# EAGLE design Sip_And_Puff_Analog_Switch (EAGLE 9.6.1)
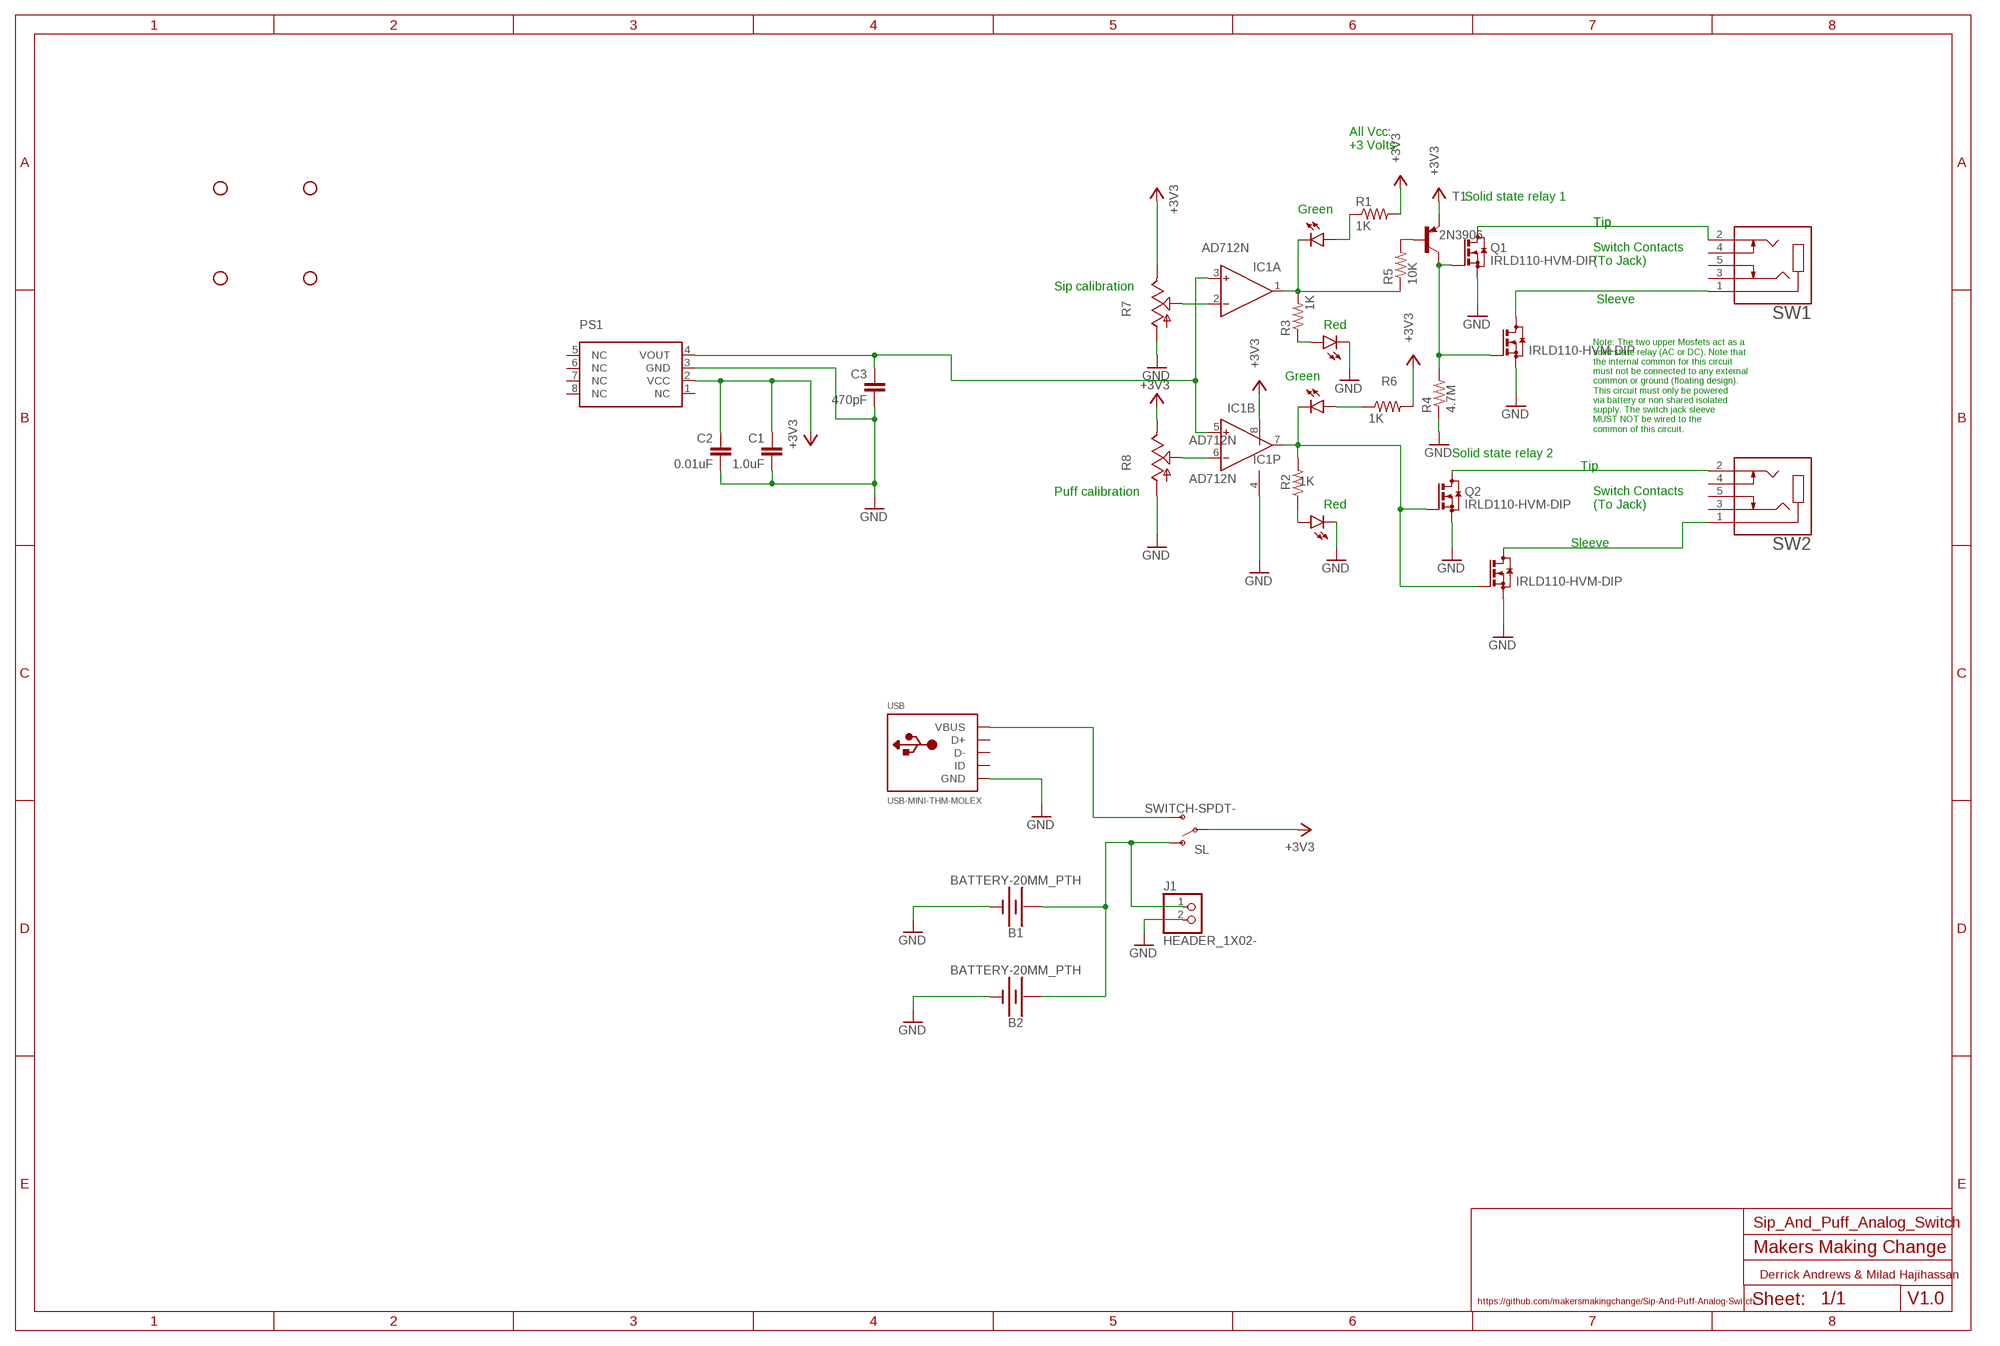
[diagram p0: schematic, sheet 1]

## Parts
B1  BATTERY-20MM_PTH  [BATTCOM_20MM_PTH]
B2  BATTERY-20MM_PTH  [BATTCOM_20MM_PTH]
C1  1.0uF  CAPACITOR-EU-  [CAP-PTH-SMALL-KIT]
C2  0.01uF  CAPACITOR-EU-  [CAP-PTH-SMALL-KIT]
C3  470pF  CAPACITOR-EU-  [CAP-PTH-SMALL-KIT]
IC1  AD712N  [DIL08]
J1  HEADER_1X02-  [1X02]
LED1  LED5MM-RED  [LED_5MM_RED]
LED2  LED5MM-RED  [LED_5MM_RED]
LED3  LED5MM-GREEN  [LED_5MM_GREEN]
LED4  LED5MM-GREEN  [LED_5MM_GREEN]
PS1  MPX-  [MXP_SOP8]
Q1  IRLD110-HVM-DIP  [HVM-DIP]
Q2  IRLD110-HVM-DIP  [HVM-DIP]
Q3  IRLD110-HVM-DIP  [HVM-DIP]
Q4  IRLD110-HVM-DIP  [HVM-DIP]
R1  1K  RESISTOR-US-0207/7  [RESISTOR_0207/7]
R2  1K  RESISTOR-US-0207/7  [RESISTOR_0207/7]
R3  1K  RESISTOR-US-0207/7  [RESISTOR_0207/7]
R4  4.7M  RESISTOR-US-0207/7  [RESISTOR_0207/7]
R5  10K  RESISTOR-US-0207/7  [RESISTOR_0207/7]
R6  1K  RESISTOR-US-0207/7  [RESISTOR_0207/7]
R7  TRIM-3386C  [3386C]
R8  TRIM-3386C  [3386C]
SL  SWITCH-SPDT-  [SPDT-RA]
STANDOFF1  STAND-OFF-  [STAND-OFF]
STANDOFF2  STAND-OFF-  [STAND-OFF]
STANDOFF3  STAND-OFF-  [STAND-OFF]
STANDOFF4  STAND-OFF-  [STAND-OFF]
SW1  CUI_SJ1-3535NGSJ1-3535NG  [CUI_SJ1-3535NG]
SW2  CUI_SJ1-3535NGSJ1-3535NG  [CUI_SJ1-3535NG]
T1  2N3906  [TO92-EBC]
USB  USB-MINI-THM-MOLEX  [USB-MINIB-THM-MOLEX]

## Nets
+3V3: C1.1 C2.1 IC1.8(P:V+) PS1.2(VCC) R1.2 R6.2 R7.E R8.E SL.2(P) T1.E
GND: B1.- B2.- C1.2 C2.2 C3.2 IC1.4(P:V-) J1.2 LED1.K(C) LED2.K(C) PS1.3(GND) Q1.2(S) Q2.2(S) Q3.2(S) Q4.2(S) R4.1 R7.A R8.A USB.GND
N$1: IC1.7(B:OUT) LED4.K(C) Q2.1(G) Q4.1(G) R2.2
N$3: SL.3(S) USB.VBUS
N$4: LED4.A R6.1
N$5: B1.+ B2.+ J1.1 SL.1(O)
N$7: Q3.3(D) SW1.1
N$9: Q1.3(D) SW1.2
N$10: Q1.1(G) Q3.1(G) R4.2 T1.C
N$11: R5.2 T1.B
N$12: IC1.1(A:OUT) LED3.K(C) R3.2 R5.1
N$13: IC1.2(A:IN-) R7.S
N$14: IC1.6(B:IN-) R8.S
N$15: C3.1 IC1.3(A:IN+) IC1.5(B:IN+) PS1.4(VOUT)
N$17: Q2.3(D) SW2.2
N$18: Q4.3(D) SW2.1
N$19: LED3.A R1.1
N$20: LED2.A R2.1
N$21: LED1.A R3.1
Unconnected: PS1.1(NC) PS1.5(NC) PS1.6(NC) PS1.7(NC) PS1.8(NC) SW1.3 SW1.4 SW1.5 SW2.3 SW2.4 SW2.5 USB.D+ USB.D- USB.ID

## Notes on the sheet
- All Vcc:
  +3 Volts
- Solid state relay 1
- Green
- Tip | Tip
- Switch Contacts
  (To Jack)
- Sip calibration
- Sleeve
- Red
- Green
- Note: The two upper Mosfets act as a
  solid state relay (AC or DC). Note that
  the internal common for this circuit
  must not be connected to any external
  common or ground (floating design).
  This circuit must only be powered
  via battery or non shared isolated
  supply. The switch jack sleeve 
  MUST NOT be wired to the
  common of this circuit.
- Solid state relay 2
- Tip
- Puff calibration
- Red
- Switch Contacts
  (To Jack)
- Sleeve
- Makers Making Change
- Derrick Andrews & Milad Hajihassan
- https://github.com/makersmakingchange/Sip-And-Puff-Analog-Switch | V1.0

## Library data of the parts
B1 B2 = MMC Eagle:BATTERY-
C1-C3 = MMC Eagle:CAPACITOR-EU-
IC1 = MMC Eagle:AD712: Dual Precision, Low Cost, High Speed BiFET Op Amp Source: http://www.analog.com/static/imported-files/data_sheets/AD712.pdf; MF: ALTERA CORPORATION; MPN: AD712JNZ; OC_FARNELL: 9604898; OC_NEWARK: 59K4554
J1 = MMC Eagle:HEADER_1X02-
LED1-LED4 = MMC Eagle:LED: LED (Generic) Standard schematic elements and footprints for 5mm, 3mm, 1206, and 0603 sized LEDs. Generic LEDs with no color specified.
PS1 = MMC Eagle:MPX-: Generic MPX pressure sensor
Q1-Q4 = MMC Eagle:IRLD110
R1-R6 = MMC Eagle:RESISTOR-US-: RESISTOR, American symbol
R7 R8 = MMC Eagle:TRIM-: POTENTIOMETER
SL = MMC Eagle:SWITCH-SPDT-
STANDOFF1-STANDOFF4 = MMC Eagle:STAND-OFF-
SW1 SW2 = MMC Eagle:CUI_SJ1-3535NG
T1 = MMC Eagle:2N3906: PNP Transistor
USB = MMC Eagle:USB-MINI-

## Net classes
2 GND2: clearance 0.205 mm to class 0, clearance 0.205 mm to class 1, clearance 0.205 mm
3 GND3: clearance 0.205 mm to class 0, clearance 0.205 mm to class 1, clearance 0.205 mm to class 2, clearance 0.205 mm

## Board
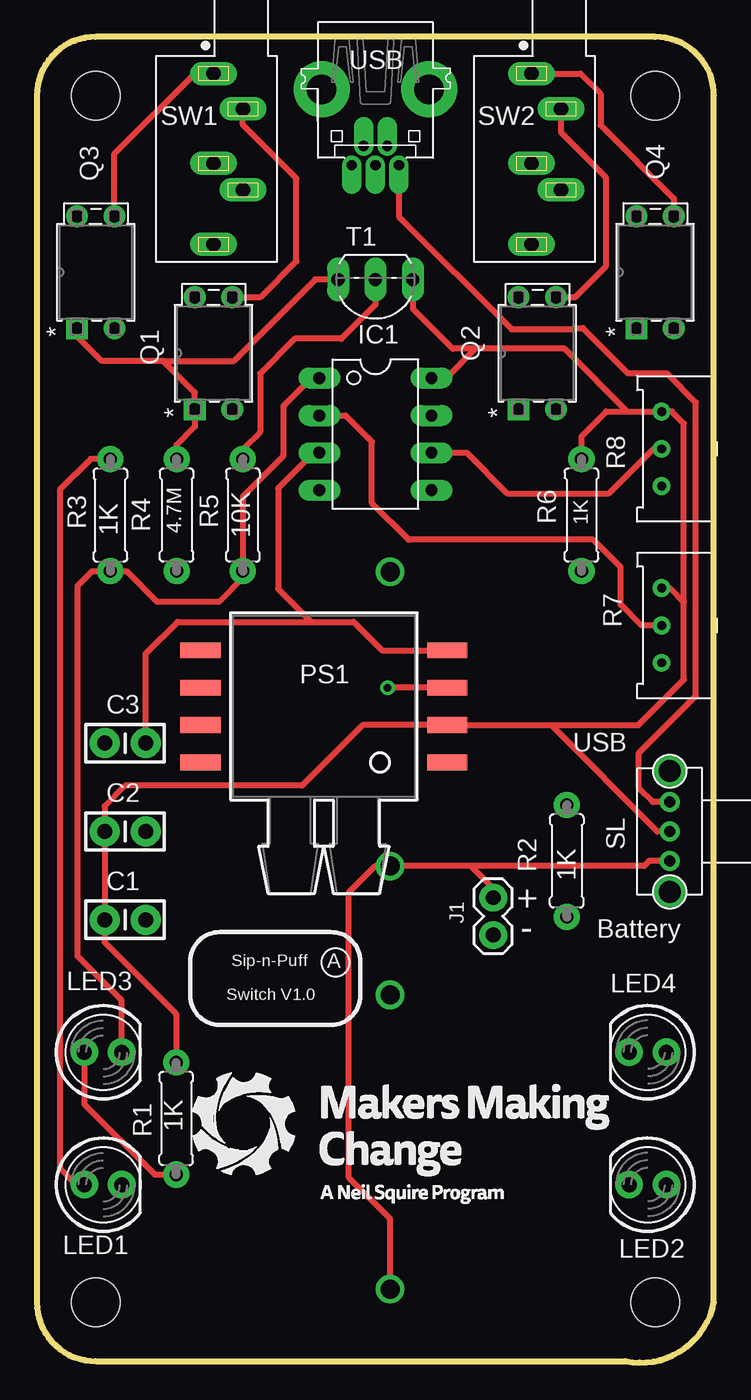
[diagram p1: board, top side]
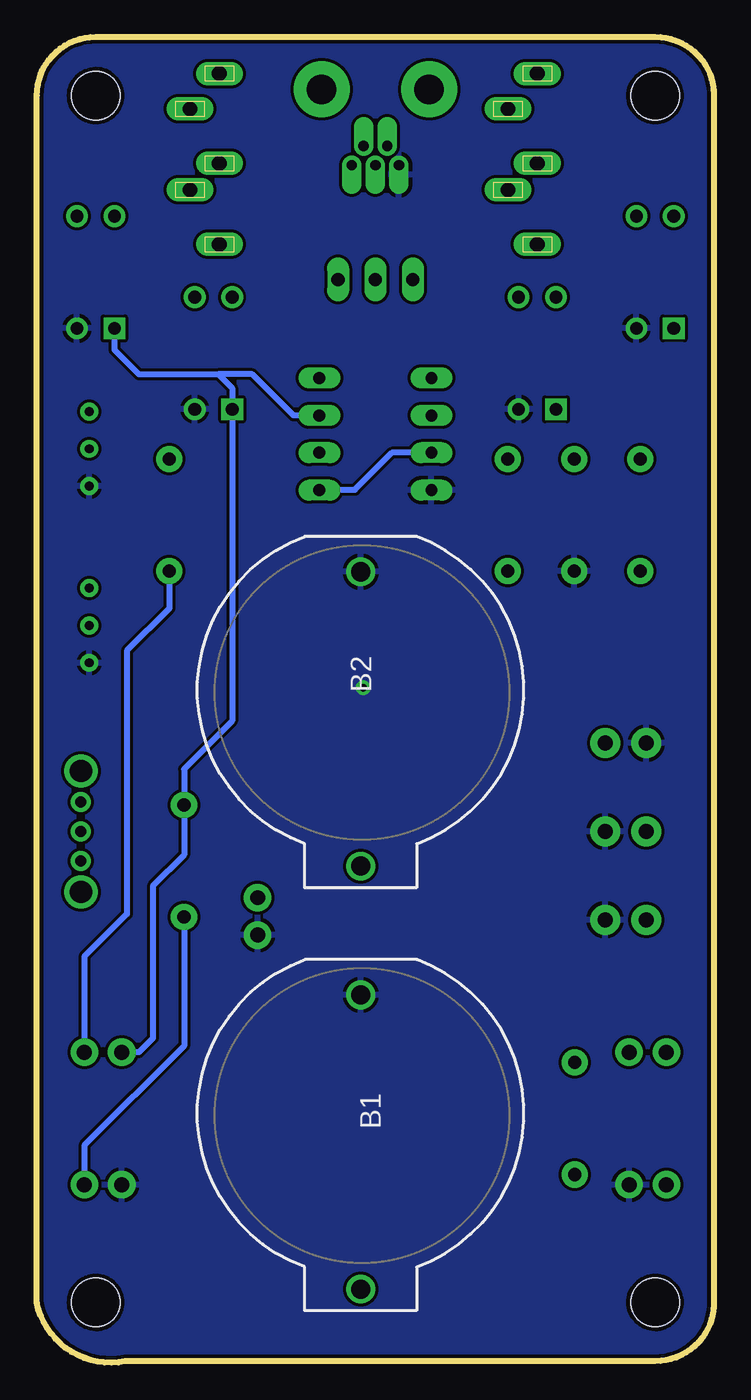
[diagram p2: board, bottom side, seen from below]

Size 46 x 90.1 mm. Coordinates in mm from the lower left corner, seen from the top.
Outline: 4,0.1 40,0.1 arc90 46,4.1 46,86.1 arc90 42,90.1 4,90.1 arc90 0,86.1 0,4.1 arc90 4,0.1
Copper layers (1*16): Top 0.035mm / dielectric 1.5mm / Bottom 0.035mm
Design rules "SparkFun": minimum track width 8mil, minimum drill 20mil, track to track 8mil, track to pad 8mil, pad to pad 8mil, via to via 8mil, smd to smd 8mil, copper to edge 10mil, drill to drill 8mil, minimum pad ring 12mil, minimum via ring 10mil, stop-mask expansion 4mil, vias tented up to drill 25mil, thermal gap 10mil

### Footprints (pad centres in the part's own frame; a part is rotated, then mirrored left to right if it is on the bottom)
BATTCOM_20MM_PTH = drill 1.3: + 11.85,0; - -8.15,0
CAP-PTH-SMALL-KIT = drill 1.016 pad 2.032: 1 -1.397,0; 2 1.397,0
DIL08 = drill 0.813 long: 1 -3.81,-3.81; 2 -1.27,-3.81; 3 1.27,-3.81; 4 3.81,-3.81; 5 3.81,3.81; 6 1.27,3.81; 7 -1.27,3.81; 8 -3.81,3.81
1X02 = drill 1.016 pad 1.88: 1 0,0; 2 2.54,0
LED_5MM_RED = drill 1.016 pad 1.88: A -1.27,0; K 1.27,0
LED_5MM_GREEN = drill 1.016 pad 1.88: A -1.27,0; K 1.27,0
MXP_SOP8 = smd 2.731 x 1.067: 1 8.382,-3.81; 2 8.382,-1.27; 3 8.382,1.27; 4 8.382,3.81; 5 -8.382,3.81; 6 -8.382,1.27; 7 -8.382,-1.27; 8 -8.382,-3.81
HVM-DIP = drill 0.864 pad 1.372 square: 1 -3.81,1.27 | drill 0.864 pad 1.372: 2 -3.81,-1.27; 3 3.81,-1.27; 4 3.81,1.27
RESISTOR_0207/7 = drill 0.889 pad 1.778: 1 -3.81,0; 2 3.81,0
3386C = drill 0.6: A 2.54,0; E -2.54,0; S 0,0
SPDT-RA = drill 0.75: 1 -2,0; 2 0,0; 3 2,0 | drill 1.5 pad 1.93: P$1 -4.1,0; P$2 4.1,0
STAND-OFF = hole 3.302: 0,0
CUI_SJ1-3535NG = drill 1 long: 1 0,0; 2 2.4,2; 3 7.9,2; 4 11.6,0; 5 6.1,0
TO92-EBC = drill 0.889 long: B 0,0; C 2.54,0; E -2.54,0
USB-MINIB-THM-MOLEX = drill 0.7 offset: D+ 0,9.72; D- -0.8,8.42; GND 1.6,9.72; ID 0.8,8.42; VBUS -1.6,9.72 | drill 2 pad 3.81: GND1 -3.65,4.57; GND4 3.65,4.57

### Placement (x,y rotation side)
B1  24,16.85 270 bottom
B2  24,45.6 270 bottom
C1  6,30.1 0 top
C2  6,36.1 0 top
C3  6,42.1 180 top
IC1  23,63.1 270 top
J1  31,31.6 270 top
LED1  4.5,12.1 0 top
LED2  41.5,12.1 180 top
LED3  4.5,21.1 0 top
LED4  41.5,21.1 180 top
PS1  19.5,44.6 0 top
Q1  12,68.6 90 top
Q2  34,68.6 90 top
Q3  4,74.1 90 top
Q4  42,74.1 90 top
R1  9.47,16.6 90 top
R2  36,34.1 90 top
R3  5,57.6 270 top
R4  9.5,57.6 90 top
R5  14,57.6 90 top
R6  37,57.6 90 top
R7  42.44,50.1 270 top
R8  42.44,62.1 270 top
SL  43,36.1 90 top
STANDOFF1  42,4.1 0 top
STANDOFF2  4,4.1 0 top
STANDOFF3  42,86.1 0 top
STANDOFF4  4,86.1 0 top
SW1  12,87.6 270 top
SW2  33.6,87.6 270 top
T1  23,73.6 180 top
USB  23,91.1 180 top

### Tracks (layer width: path | path; a pad name or v marks a point on that pad's centre or on a via)
+3V3
  Top 0.406: 40.12,64.64 41.1,64.64 R8.E 43.14,64.64 43.95,63.83 43.95,51.7 | 40.12,64.64 38.68,64.64 37,62.96 R6.2 | 40.12,64.64 35.86,68.9 29.8,68.9 | T1.E 25.54,71.62 28.26,68.9 29.8,68.9 | 43.95,51.7 43.95,46.42 40.87,43.33 34.93,43.33 | R7.E 43.02,52.64 43.95,51.7 | SL.2 42.16,36.1 34.93,43.33 | R1.2 9.47,23.7 4.6,28.57 C1.1 C2.1 4.6,37.81 6.01,39.21 18.03,39.21 22.14,43.33 PS1.2 34.93,43.33 | IC1.8 27.81,66.91 29.8,68.9
GND  (via drill 0.51)
  Top 0.406: 28.38,45.8 PS1.3 v23.83,45.87 v23.82,45.86
  pour Bottom: 4,0.1 40,0.1 arc90 46,4.1 46,86.1 arc90 40,90.1 4,90.1 arc90 0,86.1 0,4.1 arc90
N$1
  Bottom 0.406: Q4.1 40.73,68.83 39.07,67.17 33.67,67.17 | LED4.K 39.06,21.1 38.12,22.04 38.12,32.39 36,34.51 R2.2 36,40.34 32.73,43.61 Q2.1 32.73,66.23 33.67,67.17 | IC1.7 28.56,64.37 31.36,67.17 33.67,67.17
N$3
  Top 0.406: USB.VBUS 24.6,77.88 32.25,70.23 36.52,70.23 36.59,70.3 37.09,70.3 40.15,67.24 42.78,67.24 44.77,65.25 44.77,45.3 40.9,41.43 40.9,39.06 41.87,38.1 SL.3
N$4
  Bottom 0.406: LED4.A 42.77,27.6 39.88,30.48 39.88,48.38 37,51.26 R6.1
N$5
  Top 0.406: B1.+ 24,9.76 21.19,12.57 21.19,31.96 22.98,33.75 B2.+ 29.48,33.75 | SL.1 41.61,34.1 41.26,33.75 29.48,33.75 | J1.1 31,32.23 29.48,33.75
N$7
  Top 0.406: Q3.3 5.27,82.15 10.72,87.6 SW1.1
N$9
  Top 0.406: Q1.3 15.21,72.41 17.64,74.84 17.64,80.47 14,84.11 SW1.2
N$10
  Top 0.406: 8.59,68.07 13.37,68.07 18.9,73.6 T1.C | 8.59,68.07 4.42,68.07 2.73,69.76 Q3.1 | 8.59,68.07 10.73,65.93 Q1.1 10.73,63.6 9.5,62.37 R4.2
N$11
  Top 0.406: R5.2 14,62.07 15.18,63.24 15.18,67.23 17.53,69.58 20.7,69.58 23,71.89 T1.B
N$12
  Top 0.406: LED3.K 5.77,24.63 2.77,27.62 2.77,52.81 3.75,53.79 R3.2 6.09,53.79 8.18,51.7 12.38,51.7 14,53.33 R5.1 14,58.87 16.75,61.62 16.75,65 18.65,66.91 IC1.1
N$13
  Top 0.406: IC1.2 20.98,64.37 22.76,62.59 22.76,58.43 25.26,55.93 37.8,55.93 39.65,54.08 39.65,51.52 41.07,50.1 R7.S
N$14
  Top 0.406: R8.S 41.88,62.1 38.85,59.07 31.97,59.07 29.21,61.83 IC1.6
N$15
  Top 0.406: IC1.3 18.8,61.83 16.39,59.42 16.39,52.59 18.63,50.34 | C3.1 7.4,48.18 9.57,50.34 18.63,50.34 | 18.63,50.34 21.51,50.34 23.45,48.41 PS1.4
  Bottom 0.406: IC1.5 26.51,59.29 26.48,59.32 24.39,59.32 21.88,61.83 IC1.3
N$17
  Top 0.406: Q2.3 36.58,72.41 38.64,74.47 38.64,80.56 35.6,83.6 SW2.2
N$18
  Top 0.406: SW2.1 36.93,87.6 38.3,86.23 38.3,84.08 43.27,79.11 Q4.3
N$19
  Top 0.406: LED3.A 3.23,17.56 8.01,12.79 R1.1
N$20
  Bottom 0.406: LED2.A 42.77,13.79 42.77,14.37 42.77,14.76 36,21.53 R2.1
N$21
  Top 0.406: LED1.A 2.66,12.1 1.56,13.19 1.56,59.31 3.66,61.41 R3.1

### Text on the board
tPlace: Sip-n-Puff | A | Switch V1.0
tNames: USB | + | - | Battery